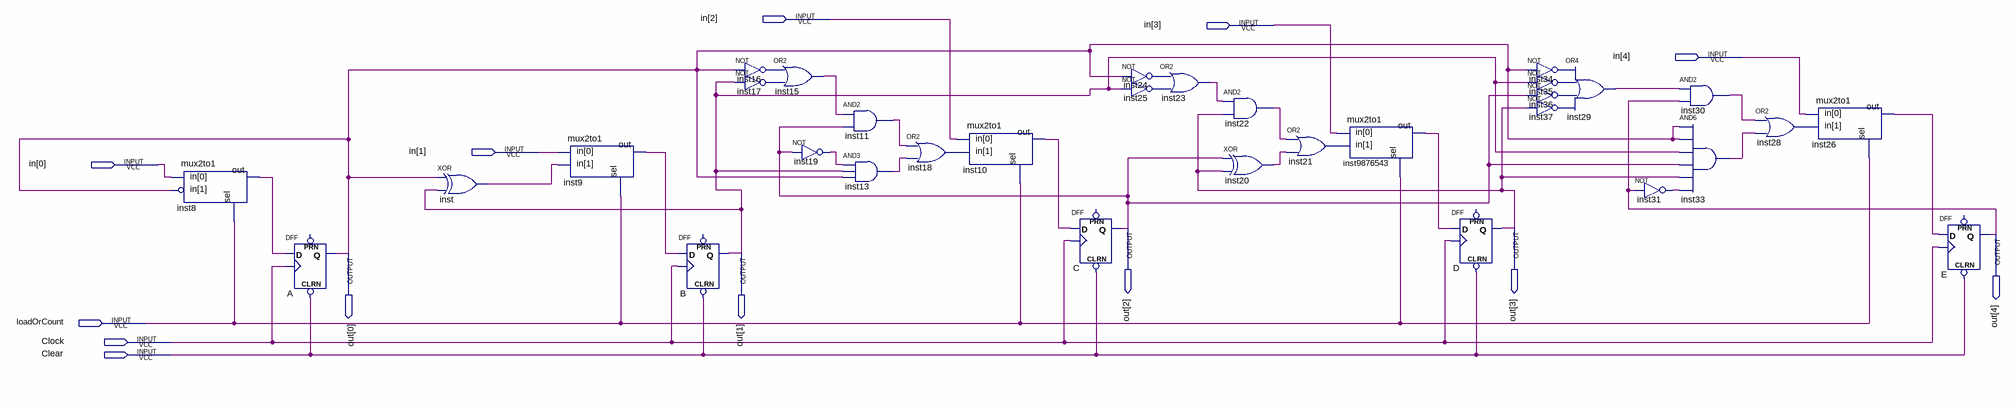
[diagram p0: schematic sheet]
// Quartus schematic counterRegister.bdf as structural Verilog: 33 symbols, 13 pins
module counterRegister (
  input  [4:0] in,
  input  loadOrCount,
  input  Clock,
  input  Clear,
  output [4:0] out
);

  wire inst8_out, inst9_out, inst10_out, inst11_out, inst13_out, inst15_out, inst16_out, inst17_out,
       inst18_out, inst19_out, inst20_out, inst21_out, inst22_out, inst23_out, inst24_out, inst25_out,
       inst26_out, inst28_out, inst29_out, inst30_out, inst31_out, inst33_out, inst34_out, inst35_out,
       inst36_out, inst37_out, inst9876543_out, inst_out;

  mux2to1 inst8 (.in({out[0], in[0]}), .sel(loadOrCount), .out(inst8_out));
  DFF A (.CLRN(Clear), .CLK(Clock), .D(inst8_out), .Q(out[0]));  // open: PRN
  xor inst (inst_out, out[0], out[1]);
  mux2to1 inst9 (.in({inst_out, in[1]}), .sel(loadOrCount), .out(inst9_out));
  DFF B (.CLRN(Clear), .CLK(Clock), .D(inst9_out), .Q(out[1]));  // open: PRN
  not inst16 (inst16_out, out[0]);
  not inst17 (inst17_out, out[1]);
  or inst15 (inst15_out, inst16_out, inst17_out);
  not inst19 (inst19_out, out[2]);
  and inst11 (inst11_out, inst15_out, out[2]);
  and inst13 (inst13_out, inst19_out, out[1], out[0]);
  or inst18 (inst18_out, inst11_out, inst13_out);
  mux2to1 inst10 (.in({inst18_out, in[2]}), .sel(loadOrCount), .out(inst10_out));
  DFF C (.CLRN(Clear), .CLK(Clock), .D(inst10_out), .Q(out[2]));  // open: PRN
  not inst24 (inst24_out, out[0]);
  not inst25 (inst25_out, out[1]);
  or inst23 (inst23_out, inst24_out, inst25_out);
  and inst22 (inst22_out, inst23_out, out[3]);
  xor inst20 (inst20_out, out[2], out[3]);
  or inst21 (inst21_out, inst22_out, inst20_out);
  mux2to1 inst9876543 (.in({inst21_out, in[3]}), .sel(loadOrCount), .out(inst9876543_out));
  DFF D (.CLRN(Clear), .CLK(Clock), .D(inst9876543_out), .Q(out[3]));  // open: PRN
  not inst34 (inst34_out, out[0]);
  not inst35 (inst35_out, out[1]);
  not inst36 (inst36_out, out[2]);
  not inst37 (inst37_out, out[3]);
  or inst29 (inst29_out, inst34_out, inst35_out, inst36_out, inst37_out);
  not inst31 (inst31_out, out[4]);
  and inst30 (inst30_out, inst29_out, out[4]);
  and inst33 (inst33_out, out[0], out[0], out[1], out[2], out[3], inst31_out);
  or inst28 (inst28_out, inst30_out, inst33_out);
  mux2to1 inst26 (.in({inst28_out, in[4]}), .sel(loadOrCount), .out(inst26_out));
  DFF E (.CLRN(Clear), .CLK(Clock), .D(inst26_out), .Q(out[4]));  // open: PRN
endmodule
